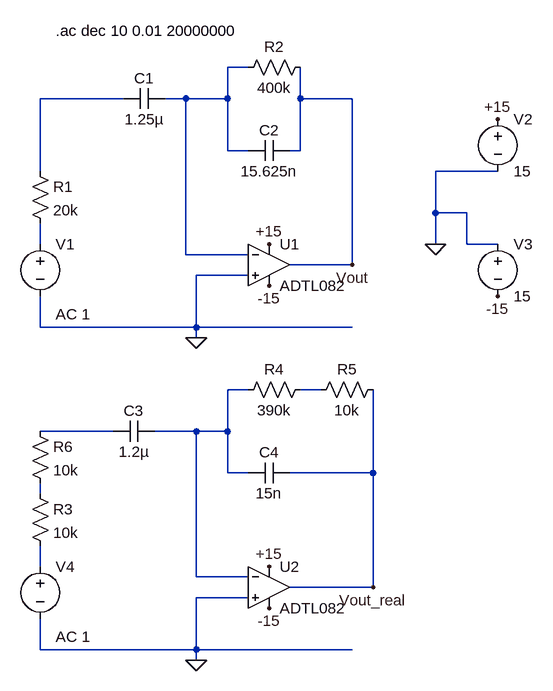
[diagram p0: schematic circuitos_3.asc]
circuitos_3.asc, the LTspice schematic file:
Version 4.1
SHEET 1 880 692
WIRE 80 -240 48 -240
WIRE -112 -192 -240 -192
WIRE -16 -192 -48 -192
WIRE 48 -192 48 -240
WIRE 48 -192 -16 -192
WIRE 160 -192 160 -240
WIRE 240 -192 160 -192
WIRE 48 -112 48 -192
WIRE 80 -112 48 -112
WIRE 160 -112 160 -192
WIRE 160 -112 144 -112
WIRE -240 -80 -240 -192
WIRE 464 -80 368 -80
WIRE 368 -16 368 -80
WIRE 416 -16 368 -16
WIRE -240 32 -240 0
WIRE 368 32 368 -16
WIRE 416 32 416 -16
WIRE 464 32 416 32
WIRE -16 48 -16 -192
WIRE 80 48 -16 48
WIRE 240 64 240 -192
WIRE 240 64 144 64
WIRE 80 80 0 80
WIRE -240 160 -240 112
WIRE 0 160 0 80
WIRE 0 160 -240 160
WIRE 240 160 0 160
WIRE 0 176 0 160
WIRE 80 256 48 256
WIRE 192 256 160 256
WIRE -128 320 -240 320
WIRE 0 320 -64 320
WIRE 48 320 48 256
WIRE 48 320 0 320
WIRE 48 384 48 320
WIRE 80 384 48 384
WIRE 272 384 272 256
WIRE 272 384 144 384
WIRE -240 416 -240 400
WIRE -240 528 -240 496
WIRE 0 544 0 320
WIRE 80 544 0 544
WIRE 272 560 272 384
WIRE 272 560 144 560
WIRE 80 576 0 576
WIRE -240 656 -240 608
WIRE 0 656 0 576
WIRE 0 656 -240 656
WIRE 240 656 0 656
WIRE 0 672 0 656
FLAG 0 176 0
FLAG 368 32 0
FLAG 464 -160 +15
FLAG 112 32 +15
FLAG 464 112 -15
FLAG 112 96 -15
FLAG 240 64 Vout
FLAG 0 672 0
FLAG 112 528 +15
FLAG 112 592 -15
FLAG 272 560 Vout_real
SYMBOL OpAmps\\ADTL082 112 0 R0
SYMATTR InstName U1
SYMBOL res -256 -96 R0
SYMATTR InstName R1
SYMATTR Value 20k
SYMBOL res 176 -256 R90
WINDOW 0 0 56 VBottom 2
WINDOW 3 32 56 VTop 2
SYMATTR InstName R2
SYMATTR Value 400k
SYMBOL cap -48 -208 R90
WINDOW 0 0 32 VBottom 2
WINDOW 3 32 32 VTop 2
SYMATTR InstName C1
SYMATTR Value 1.25µ
SYMBOL cap 144 -128 R90
WINDOW 0 0 32 VBottom 2
WINDOW 3 32 32 VTop 2
SYMATTR InstName C2
SYMATTR Value 15.625n
SYMBOL voltage -240 16 R0
WINDOW 123 24 124 Left 2
WINDOW 39 0 0 Left 0
SYMATTR InstName V1
SYMATTR Value ""
SYMATTR Value2 AC 1
SYMBOL voltage 464 -176 R0
SYMATTR InstName V2
SYMATTR Value 15
SYMBOL voltage 464 16 R0
SYMATTR InstName V3
SYMATTR Value 15
SYMBOL OpAmps\\ADTL082 112 496 R0
SYMATTR InstName U2
SYMBOL res -256 400 R0
SYMATTR InstName R3
SYMATTR Value 10k
SYMBOL res 176 240 R90
WINDOW 0 0 56 VBottom 2
WINDOW 3 32 56 VTop 2
SYMATTR InstName R4
SYMATTR Value 390k
SYMBOL cap -64 304 R90
WINDOW 0 0 32 VBottom 2
WINDOW 3 32 32 VTop 2
SYMATTR InstName C3
SYMATTR Value 1.2µ
SYMBOL cap 144 368 R90
WINDOW 0 0 32 VBottom 2
WINDOW 3 32 32 VTop 2
SYMATTR InstName C4
SYMATTR Value 15n
SYMBOL voltage -240 512 R0
WINDOW 123 24 124 Left 2
WINDOW 39 0 0 Left 0
SYMATTR InstName V4
SYMATTR Value ""
SYMATTR Value2 AC 1
SYMBOL res 288 240 R90
WINDOW 0 0 56 VBottom 2
WINDOW 3 32 56 VTop 2
SYMATTR InstName R5
SYMATTR Value 10k
SYMBOL res -256 304 R0
SYMATTR InstName R6
SYMATTR Value 10k
TEXT -216 -296 Left 2 !.ac dec 10 0.01 20000000

The netlist it stands for:
* circuitos_3.asc
X§U1 0 N001 +15 -15 Vout ADTL082  ; pins In+ In- V+ V- OUT
R1 N002 N003 20k
R2 Vout N001 400k
C1 N001 N002 1.25µ
C2 Vout N001 15.625n
V1 N003 0 AC 1
V2 +15 0 15
V3 0 -15 15
X§U2 0 N004 +15 -15 Vout_real ADTL082  ; pins In+ In- V+ V- OUT
R3 N007 N008 10k
R4 N005 N004 390k
C3 N004 N006 1.2µ
C4 Vout_real N004 15n
V4 N008 0 AC 1
R5 Vout_real N005 10k
R6 N006 N007 10k
.ac dec 10 0.01 20000000
.lib ADI.lib
.backanno
.end